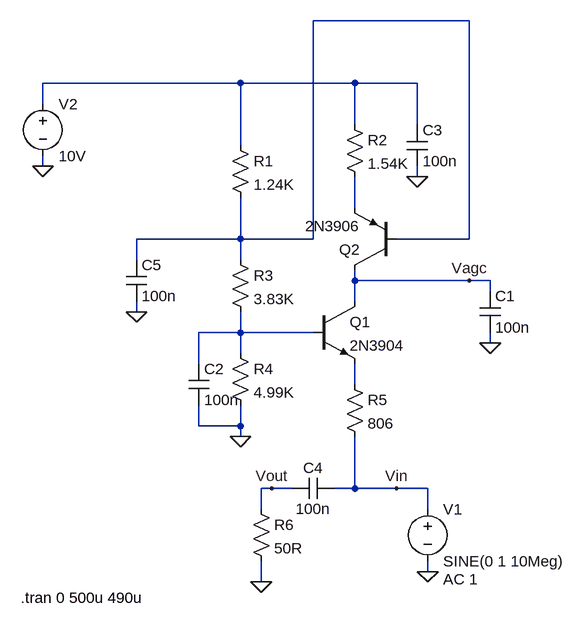
[diagram p0: schematic AGC Test.asc]
AGC Test.asc, the LTspice schematic file:
Version 4
SHEET 1 880 680
WIRE 560 -224 320 -224
WIRE 208 -128 -96 -128
WIRE 384 -128 208 -128
WIRE 480 -128 384 -128
WIRE -96 -96 -96 -128
WIRE 384 -64 384 -128
WIRE 480 -64 480 -128
WIRE 208 -32 208 -128
WIRE -96 0 -96 -16
WIRE 480 16 480 0
WIRE 384 64 384 16
WIRE 208 112 208 48
WIRE 208 112 48 112
WIRE 320 112 320 -224
WIRE 320 112 208 112
WIRE 560 112 560 -224
WIRE 560 112 448 112
WIRE 48 144 48 112
WIRE 208 144 208 112
WIRE 384 176 384 160
WIRE 560 176 384 176
WIRE 592 176 560 176
WIRE 592 192 592 176
WIRE 384 208 384 176
WIRE 48 224 48 208
WIRE 208 256 208 224
WIRE 208 256 144 256
WIRE 320 256 208 256
WIRE 592 272 592 256
WIRE 208 288 208 256
WIRE 144 304 144 256
WIRE 384 336 384 304
WIRE 144 400 144 368
WIRE 208 400 208 368
WIRE 208 400 144 400
WIRE 208 416 208 400
WIRE 256 496 240 496
WIRE 288 496 256 496
WIRE 384 496 384 416
WIRE 384 496 352 496
WIRE 448 496 384 496
WIRE 496 496 448 496
WIRE 240 528 240 496
WIRE 496 528 496 496
WIRE 496 624 496 608
WIRE 240 640 240 608
FLAG -96 0 0
FLAG 496 624 0
FLAG 592 272 0
FLAG 208 416 0
FLAG 480 16 0
FLAG 240 640 0
FLAG 560 176 Vagc
FLAG 448 496 Vin
FLAG 256 496 Vout
FLAG 48 224 0
SYMBOL npn 320 208 R0
SYMATTR InstName Q1
SYMATTR Value 2N3904
SYMBOL pnp 448 160 R180
SYMATTR InstName Q2
SYMATTR Value 2N3906
SYMBOL voltage 496 512 R0
WINDOW 123 24 124 Left 2
WINDOW 39 0 0 Left 2
SYMATTR InstName V1
SYMATTR Value SINE(0 1 10Meg)
SYMATTR Value2 AC 1
SYMBOL voltage -96 -112 R0
WINDOW 123 0 0 Left 2
WINDOW 39 0 0 Left 2
SYMATTR InstName V2
SYMATTR Value 10V
SYMBOL cap 576 192 R0
SYMATTR InstName C1
SYMATTR Value 100n
SYMBOL res 192 -48 R0
SYMATTR InstName R1
SYMATTR Value 1.24K
SYMBOL res 368 -80 R0
SYMATTR InstName R2
SYMATTR Value 1.54K
SYMBOL res 192 128 R0
SYMATTR InstName R3
SYMATTR Value 3.83K
SYMBOL res 192 272 R0
SYMATTR InstName R4
SYMATTR Value 4.99K
SYMBOL res 368 320 R0
SYMATTR InstName R5
SYMATTR Value 806
SYMBOL cap 128 304 R0
SYMATTR InstName C2
SYMATTR Value 100n
SYMBOL cap 464 -64 R0
SYMATTR InstName C3
SYMATTR Value 100n
SYMBOL cap 352 480 R90
WINDOW 0 0 32 VBottom 2
WINDOW 3 32 32 VTop 2
SYMATTR InstName C4
SYMATTR Value 100n
SYMBOL res 224 512 R0
SYMATTR InstName R6
SYMATTR Value 50R
SYMBOL cap 32 144 R0
SYMATTR InstName C5
SYMATTR Value 100n
TEXT -130 664 Left 2 !.tran 0 500u 490u

The netlist it stands for:
* AGC Test.asc
Q1 Vagc N004 N005 0 2N3904
Q2 Vagc N001 N003 0 2N3906
V1 Vin 0 SINE(0 1 10Meg) AC 1
V2 N002 0 10V
C1 Vagc 0 100n
R1 N002 N001 1.24K
R2 N002 N003 1.54K
R3 N001 N004 3.83K
R4 N004 0 4.99K
R5 N005 Vin 806
C2 N004 0 100n
C3 N002 0 100n
C4 Vin Vout 100n
R6 Vout 0 50R
C5 N001 0 100n
.model NPN NPN
.model PNP PNP
.lib standard.bjt
.tran 0 500u 490u
.backanno
.end